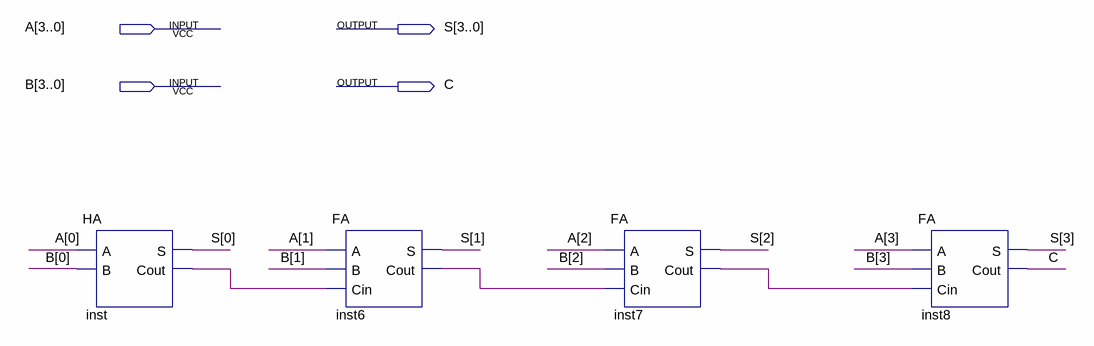
[diagram p0: schematic sheet]
// Quartus schematic LAB01.bdf as structural Verilog: 4 symbols, 4 pins
module LAB01 (
  input  [3:0] A,
  input  [3:0] B,
  output [3:0] S,
  output C
);

  wire inst6_cout, inst7_cout, inst_cout;

  HA inst (.A(A[0]), .B(B[0]), .S(S[0]), .Cout(inst_cout));
  FA inst6 (.A(A[1]), .B(B[1]), .Cin(inst_cout), .S(S[1]), .Cout(inst6_cout));
  FA inst7 (.A(A[2]), .B(B[2]), .Cin(inst6_cout), .S(S[2]), .Cout(inst7_cout));
  FA inst8 (.A(A[3]), .B(B[3]), .Cin(inst7_cout), .S(S[3]), .Cout(C));
endmodule
